# Altium schematic sheet DO.SchDoc
size 420 x 297 mm; SheetNumber: 5; SheetTotal: 13
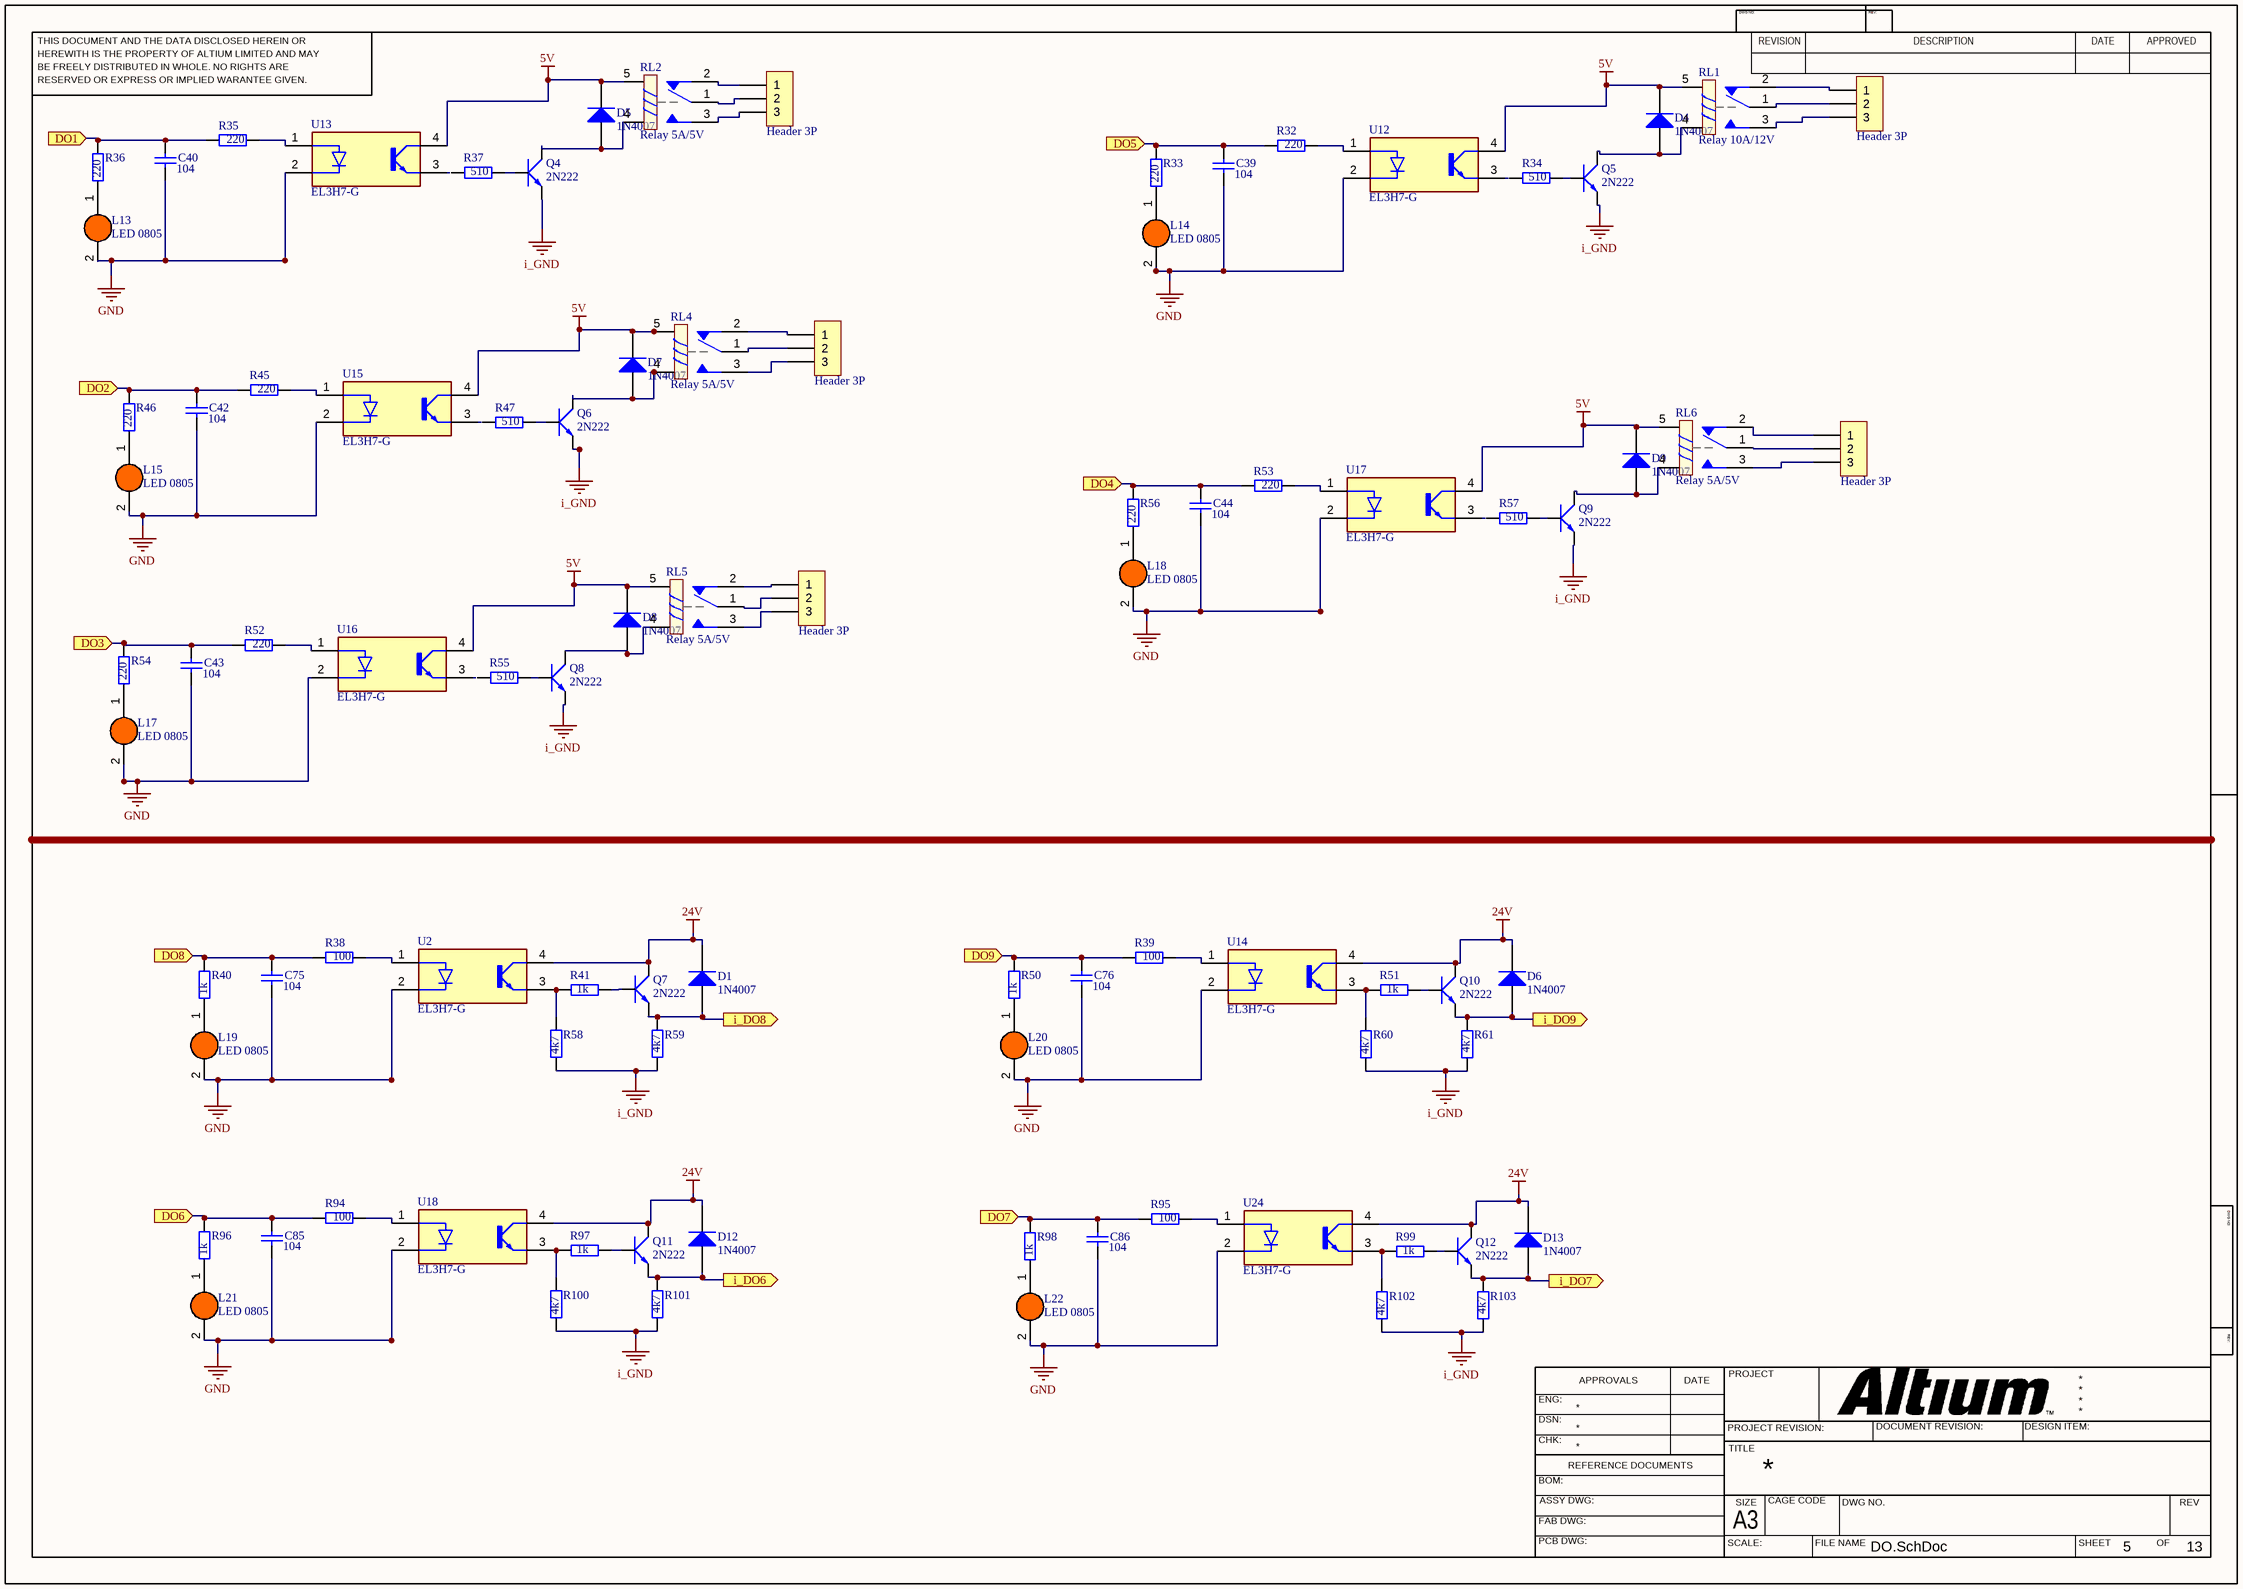
[diagram p0: DO.SchDoc]

## Parts
C39  104  [0603_Cap]
C40  104  [0603_Cap]
C42  104  [0603_Cap]
C43  104  [0603_Cap]
C44  104  [0603_Cap]
C75  104  [0603_Cap]
C76  104  [0603_Cap]
C85  104  [0603_Cap]
C86  104  [0603_Cap]
D1  1N4007  [SMA - DO-214AC]
D4  1N4007  [SMA - DO-214AC]
D5  1N4007  [SMA - DO-214AC]
D6  1N4007  [SMA - DO-214AC]
D7  1N4007  [SMA - DO-214AC]
D8  1N4007  [SMA - DO-214AC]
D9  1N4007  [SMA - DO-214AC]
D12  1N4007  [SMA - DO-214AC]
D13  1N4007  [SMA - DO-214AC]
H17  Header 3P  [CON 3 EDG5.08-3P]
H18  Header 3P  [CON 3 EDG5.08-3P]
H20  Header 3P  [CON 3 EDG5.08-3P]
H21  Header 3P  [CON 3 EDG5.08-3P]
H22  Header 3P  [CON 3 EDG5.08-3P]
L13  LED 0805  [LED-0805-Orange]
L14  LED 0805  [LED-0805-Orange]
L15  LED 0805  [LED-0805-Orange]
L17  LED 0805  [LED-0805-Orange]
L18  LED 0805  [LED-0805-Orange]
L19  LED 0805  [LED-0805-Orange]
L20  LED 0805  [LED-0805-Orange]
L21  LED 0805  [LED-0805-Orange]
L22  LED 0805  [LED-0805-Orange]
Q4  2N222  [SOT23-231]
Q5  2N222  [SOT23-231]
Q6  2N222  [SOT23-231]
Q7  2N222  [SOT23-231]
Q8  2N222  [SOT23-231]
Q9  2N222  [SOT23-231]
Q10  2N222  [SOT23-231]
Q11  2N222  [SOT23-231]
Q12  2N222  [SOT23-231]
R32  220  [0603_Res]
R33  220  [0603_Res]
R34  510  [0603_Res]
R35  220  [0603_Res]
R36  220  [0603_Res]
R37  510  [0603_Res]
R38  100  [0603_Res]
R39  100  [0603_Res]
R40  1k  [0603_Res]
R41  1k  [0603_Res]
R45  220  [0603_Res]
R46  220  [0603_Res]
R47  510  [0603_Res]
R50  1k  [0603_Res]
R51  1k  [0603_Res]
R52  220  [0603_Res]
R53  220  [0603_Res]
R54  220  [0603_Res]
R55  510  [0603_Res]
R56  220  [0603_Res]
R57  510  [0603_Res]
R58  4k7  [0603_Res]
R59  4k7  [0603_Res]
R60  4k7  [0603_Res]
R61  4k7  [0603_Res]
R94  100  [0603_Res]
R95  100  [0603_Res]
R96  1k  [0603_Res]
R97  1k  [0603_Res]
R98  1k  [0603_Res]
R99  1k  [0603_Res]
R100  4k7  [0603_Res]
R101  4k7  [0603_Res]
R102  4k7  [0603_Res]
R103  4k7  [0603_Res]
RL1  Relay 10A/12V  [RL_SPDT_10A]
RL2  Relay 5A/5V  [RL_SPDT_10A]
RL4  Relay 5A/5V  [RL_SPDT_10A]
RL5  Relay 5A/5V  [RL_SPDT_10A]
RL6  Relay 5A/5V  [RL_SPDT_10A]
U2  EL3H7-G  [SSOP-4]
U12  EL3H7-G  [SSOP-4]
U13  EL3H7-G  [SSOP-4]
U14  EL3H7-G  [SSOP-4]
U15  EL3H7-G  [SSOP-4]
U16  EL3H7-G  [SSOP-4]
U17  EL3H7-G  [SSOP-4]
U18  EL3H7-G  [SSOP-4]
U24  EL3H7-G  [SSOP-4]

## Ports
DO1 (in), DO2 (in), DO3 (in), DO4 (in), DO5 (in), DO6 (in), DO7 (in), DO8 (in), DO9 (in), i_DO6 (out), i_DO7 (out), i_DO8 (out), i_DO9 (out)

## Nets
5V: D4.1 D5.1 D7.1 D8.1 D9.1 RL1.5 RL2.5 RL4.5 RL5.5 RL6.5 U12.4(CO) U13.4(CO) U15.4(CO) U16.4(CO) U17.4(CO)
24V: D1.1 D6.1 D12.1 D13.1 Q7.3(C) Q10.3(C) Q11.3(C) Q12.3(C) U2.4(CO) U14.4(CO) U18.4(CO) U24.4(CO)
GND: C39.2 C40.2 C42.2 C43.2 C44.2 C75.2 C76.2 C85.2 C86.2 L13.2(K) L14.2(K) L15.2(K) L17.2(K) L18.2(K) L19.2(K) L20.2(K) L21.2(K) L22.2(K) U2.2(C) U12.2(C) U13.2(C) U14.2(C) U15.2(C) U16.2(C) U17.2(C) U18.2(C) U24.2(C)
i_GND: Q4.1(E) Q5.1(E) Q6.1(E) Q8.1(E) Q9.1(E) R58.1 R59.1 R60.1 R61.1 R100.1 R101.1 R102.1 R103.1
DO1: C40.1 R35.1 R36.2 ; port DO1
DO2: C42.1 R45.1 R46.2 ; port DO2
DO3: C43.1 R52.1 R54.2 ; port DO3
DO4: C44.1 R53.1 R56.2 ; port DO4
DO5: C39.1 R32.1 R33.2 ; port DO5
DO6: C85.1 R94.1 R96.2 ; port DO6
DO7: C86.1 R95.1 R98.2 ; port DO7
DO8: C75.1 R38.1 R40.2 ; port DO8
DO9: C76.1 R39.1 R50.2 ; port DO9
i_DO6: D12.2 Q11.1(E) R101.2 ; port i_DO6
i_DO7: D13.2 Q12.1(E) R103.2 ; port i_DO7
i_DO8: D1.2 Q7.1(E) R59.2 ; port i_DO8
i_DO9: D6.2 Q10.1(E) R61.2 ; port i_DO9
NetD4_2: D4.2 Q5.3(C) RL1.4
NetD5_2: D5.2 Q4.3(C) RL2.4
NetD7_2: D7.2 Q6.3(C) RL4.4
NetD8_2: D8.2 Q8.3(C) RL5.4
NetD9_2: D9.2 Q9.3(C) RL6.4
NetH17_1: H17.1 RL1.2
NetH17_2: H17.2 RL1.1
NetH17_3: H17.3 RL1.3
NetH18_1: H18.1 RL2.2
NetH18_2: H18.2 RL2.1
NetH18_3: H18.3 RL2.3
NetH20_1: H20.1 RL4.2
NetH20_2: H20.2 RL4.1
NetH20_3: H20.3 RL4.3
NetH21_1: H21.1 RL5.2
NetH21_2: H21.2 RL5.1
NetH21_3: H21.3 RL5.3
NetH22_1: H22.1 RL6.2
NetH22_2: H22.2 RL6.1
NetH22_3: H22.3 RL6.3
NetL13_1: L13.1(A) R36.1
NetL14_1: L14.1(A) R33.1
NetL15_1: L15.1(A) R46.1
NetL17_1: L17.1(A) R54.1
NetL18_1: L18.1(A) R56.1
NetL19_1: L19.1(A) R40.1
NetL20_1: L20.1(A) R50.1
NetL21_1: L21.1(A) R96.1
NetL22_1: L22.1(A) R98.1
NetQ4_2: Q4.2(B) R37.2
NetQ5_2: Q5.2(B) R34.2
NetQ6_2: Q6.2(B) R47.2
NetQ7_2: Q7.2(B) R41.2
NetQ8_2: Q8.2(B) R55.2
NetQ9_2: Q9.2(B) R57.2
NetQ10_2: Q10.2(B) R51.2
NetQ11_2: Q11.2(B) R97.2
NetQ12_2: Q12.2(B) R99.2
NetR32_2: R32.2 U12.1(A)
NetR35_2: R35.2 U13.1(A)
NetR38_2: R38.2 U2.1(A)
NetR39_2: R39.2 U14.1(A)
NetR41_1: R41.1 R58.2 U2.3(E)
NetR45_2: R45.2 U15.1(A)
NetR51_1: R51.1 R60.2 U14.3(E)
NetR52_2: R52.2 U16.1(A)
NetR53_2: R53.2 U17.1(A)
NetR94_2: R94.2 U18.1(A)
NetR95_2: R95.2 U24.1(A)
NetR97_1: R97.1 R100.2 U18.3(E)
NetR99_1: R99.1 R102.2 U24.3(E)

Not connected (* = marked no-connect by the designer): R34 1; R37 1; R47 1; R55 1; R57 1; U12 3(E); U13 3(E); U15 3(E); U16 3(E); U17 3(E)

## Notes on the sheet
- THIS DOCUMENT AND THE DATA DISCLOSED HEREIN OR
- HEREWITH IS THE PROPERTY OF ALTIUM LIMITED AND MAY
- DWG NO:
- REVISION
- REV:
- DESCRIPTION
- DATE
- APPROVED
- BE FREELY DISTRIBUTED IN WHOLE. NO RIGHTS ARE
- RESERVED OR EXPRESS OR IMPLIED WARANTEE GIVEN.
- ENG:
- APPROVALS
- PROJECT
- DSN:
- CHK:
- REFERENCE DOCUMENTS
- PROJECT REVISION:
- TITLE
- DOCUMENT REVISION:
- DESIGN ITEM:
- BOM:
- FAB DWG:
- PCB DWG:
- ASSY DWG:
- SCALE:
- A3
- SIZE
- CAGE CODE
- FILE NAME
- DWG NO.
- SHEET
- OF
- REV

## Library data of the parts
C39 C40 C42-C44 C75 C76 C85 C86 = Ceramic Capacitor: Chung_Loai: Dán; Don_Vi: Con; So_Chan: 2; Ten_Linh_Kien: Tụ 0805 104-100nF 10% 50V; Ma_Hang: MH004551; Kieu_Chan: *
D1 D4-D9 D12 D13 = Diode: Ten_Linh_Kien: Diode S4 SOD123 ( 1N5819 SOD123); Ma_Hang: MH005519; Chung_Loai: Dán; Don_Vi: Con; Ghi_Chu: *; Kieu_Chan: *
H17 H18 H20-H22 = Header 3P: THT; Ten_Linh_Kien: Header 3P XH2.54-3P Đực Cong; Don_Vi: Con; Ma_Hang: MH001302; Chung_Loai: Cắm
L13-L15 L17-L22 = LED 0805 Cam: Dán; Don_Vi: Con; Ma_Hang: MH002328; Ten_Linh_Kien: LED 0805 Màu Cam ( Orange); Ghi_Chu: *; Kieu_Chan: *; Chung_Loai: Dán
Q4-Q12 = 2N222: NPN 600mW, ECB; Value: C1815
R32-R41 R45-R47 R50-R61 R94-R103 = Resistor: Chung_Loai: Dán; Don_Vi: Con; So_Chan: 2; Ten_Linh_Kien: Trở 0805 1% 1k; Ma_Hang: MH005468; Kieu_Chan: *
RL1 RL2 RL4-RL6 = Relay 1: Relay SPDT,10A - 12VDC 5 Pin; Value: Relay SPDT, 10A, 12V
U2 U12-U18 U24 = EL3H7-G: Optoisolator Transistor Output 3750Vrms 1 Channel 4-SSOP; MF: Everlight Electronics; Check_prices: https://www.snapeda.com/parts/EL3H7-G/Everlight+Electronics+Co+Ltd/view-part/?ref=eda; Value: *; Availability: In Stock; MP: EL3H7-G; Price: None; Package: SSOP-4 Everlight Electronics; SnapEDA_Link: https://www.snapeda.com/parts/EL3H7-G/Everlight+Electronics+Co+Ltd/view-part/?ref=snap